# EAGLE schematic seg_v2 (EAGLE 7.7.0)
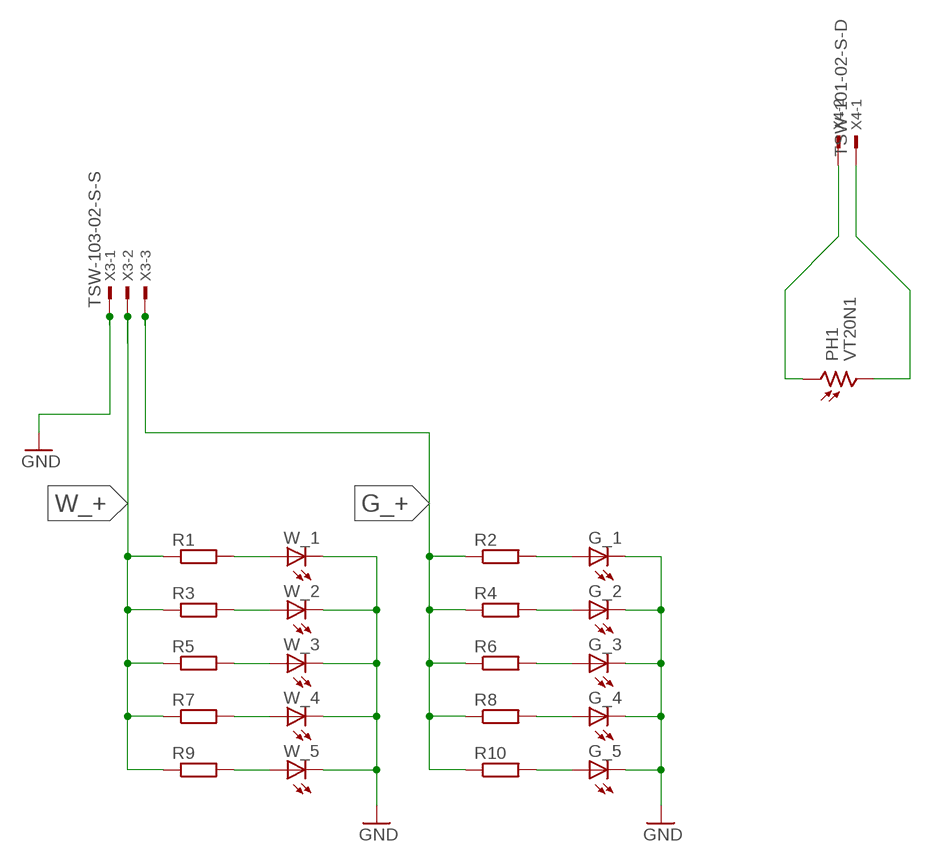
[diagram p0: schematic, sheet 1]

## Parts
G_1  LEDSML0603  [SML0603]
G_2  LEDSML0603  [SML0603]
G_3  LEDSML0603  [SML0603]
G_4  LEDSML0603  [SML0603]
G_5  LEDSML0603  [SML0603]
PH1  VT20N1  [TO46-VT200]
R1  R-EU_R0603  [R0603]
R2  R-EU_R0603  [R0603]
R3  R-EU_R0603  [R0603]
R4  R-EU_R0603  [R0603]
R5  R-EU_R0603  [R0603]
R6  R-EU_R0603  [R0603]
R7  R-EU_R0603  [R0603]
R8  R-EU_R0603  [R0603]
R9  R-EU_R0603  [R0603]
R10  R-EU_R0603  [R0603]
W_1  LEDSML0603  [SML0603]
W_2  LEDSML0603  [SML0603]
W_3  LEDSML0603  [SML0603]
W_4  LEDSML0603  [SML0603]
W_5  LEDSML0603  [SML0603]
X3  TSW-103-02-S-S  [TSW-103-02-S-S]
X4  TSW-101-02-S-D  [TSW-101-02-S-D]

## Nets
G_+: R2.1 R4.1 R6.1 R8.1 R10.1 X3.3
GND: G_1.C G_2.C G_3.C G_4.C G_5.C W_1.C W_2.C W_3.C W_4.C W_5.C X3.1
N$1: G_1.A R2.2
N$2: G_2.A R4.2
N$3: G_3.A R6.2
N$4: G_4.A R8.2
N$5: G_5.A R10.2
N$6: PH1.2 X4.1
N$7: PH1.1 X4.2
N$9: R1.2 W_1.A
N$10: R3.2 W_2.A
N$11: R5.2 W_3.A
N$12: R7.2 W_4.A
N$13: R9.2 W_5.A
W_+: R1.1 R3.1 R5.1 R7.1 R9.1 X3.2

## Library data of the parts
G_1-G_5 W_1-W_5 = led:LED: LED OSRAM: - CHIPLED LG R971, LG N971, LY N971, LG Q971, LY Q971, LO R971, LY R971 LH N974, LH R974 LS Q976, LO Q976, LY Q976 LO Q996 - Hyper CHIPLED LW Q18S LB Q993, LB Q99A, LB R99A - SideLED LS A670, LO A670, LY A670, LG A670, LP A670 LB A673, LV A673, LT A673, LW A673 LH A674 LY A675 LS A676, LA A676, LO A676, LY A676, LW A676 LS A679, LY A679, LG A679 - Hyper Micro SIDELED® LS Y876, LA Y876, LO Y876, LY Y876 LT Y87S - SmartLED LW L88C, LW L88S LB L89C, LB L89S, LG L890 LS L89K, LO L89K, LY L89K LS L896, LA L896, LO L896, LY L896 - TOPLED LS T670, LO T670, LY T670, LG T670, LP T670 LSG T670, LSP T670, LSY T670, LOP T670, LYG T670 LG T671, LOG T671, LSG T671 LB T673, LV T673, LT T673, LW T673 LH T674 LS T676, LA T676, LO T676, LY T676, LB T676, LH T676, LSB T676, LW T676 LB T67C, LV T67C, LT T67C, LS T67K, LO T67K, LY T67K, LW E67C LS E67B, LA E67B, LO E67B, LY E67B, LB E67C, LV E67C, LT E67C LW T67C LS T679, LY T679, LG T679 LS T770, LO T770, LY T770, LG T770, LP T770 LB T773, LV T773, LT T773, LW T773 LH T774 LS E675, LA E675, LY E675, LS T675 LS T776, LA T776, LO T776, LY T776, LB T776 LHGB T686 LT T68C, LB T68C - Hyper Mini TOPLED® LB M676 - Mini TOPLED Santana® LG M470 LS M47K, LO M47K, LY M47K Source: http://www.osram.convergy.de LUXEON: - LUMILED® LXK2-PW12-R00, LXK2-PW12-S00, LXK2-PW14-U00, LXK2-PW14-V00 LXK2-PM12-R00, LXK2-PM12-S00, LXK2-PM14-U00 LXK2-PE12-Q00, LXK2-PE12-R00, LXK2-PE12-S00, LXK2-PE14-T00, LXK2-PE14-U00 LXK2-PB12-K00, LXK2-PB12-L00, LXK2-PB12-M00, LXK2-PB14-N00, LXK2-PB14-P00, LXK2-PB14-Q00 LXK2-PR12-L00, LXK2-PR12-M00, LXK2-PR14-Q00, LXK2-PR14-R00 LXK2-PD12-Q00, LXK2-PD12-R00, LXK2-PD12-S00 LXK2-PH12-R00, LXK2-PH12-S00 LXK2-PL12-P00, LXK2-PL12-Q00, LXK2-PL12-R00 Source: www.luxeon.com KINGBRIGHT: KA-3528ASYC Source: www.kingbright.com
PH1 = photo-elements:VT2*: Photoconductive Cell VT200 Series Source: http://optoelectronics.perkinelmer.com/content/Datasheets/DTS_vt200seriesdatasheet.pdf
R1-R10 = rcl:R-EU_: RESISTOR, European symbol
X3 = con-samtec:TSW-103-02-S-S: THROUGH-HOLE .025" SQ POST HEADER Source: Samtec TSW.pdf; OC_FARNELL: unknown; OC_NEWARK: unknown
X4 = con-samtec:TSW-101-02-S-D: THROUGH-HOLE .025" SQ POST HEADER Source: Samtec TSW.pdf

## Net classes
0 default: width 0.305 mm